# Altium project +5V2576输出模块.PrjPcb
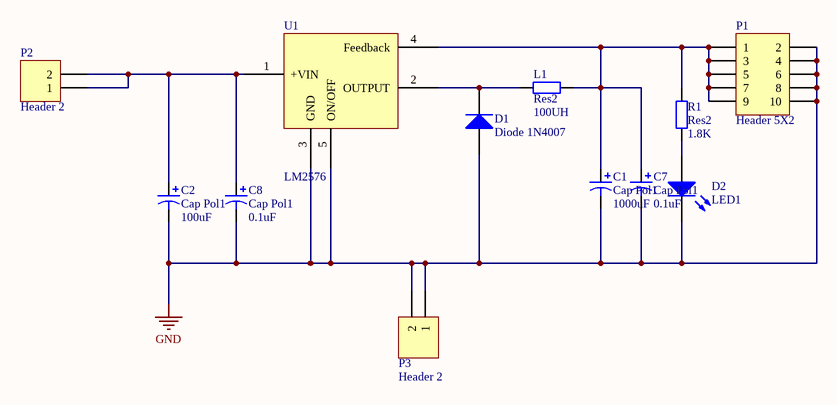
[diagram p0: +5V 2576.SchDoc]
1 sheet, 12 parts. Net scope: global (net labels, ports and power ports of the same name join across sheets).
Board file: PCB2576 5V.PcbDoc

## Sheet +5V 2576.SchDoc
size A4

### Parts
C1  Cap Pol1  value 1000uF  [CAPR5-4X5]
C2  Cap Pol1  value 100uF  [CAPR5-4X5]
C7  Cap Pol1  value 0.1uF  [CAPR5-4X5]
C8  Cap Pol1  value 0.1uF  [CAPR5-4X5]
D1  Diode 1N4007  [SMB]
D2  LED1  [LED-1]
L1  Res2  value 100UH  [AXIAL-0.4]
P1  Header 5X2  [HDR2X5]
P2  Header 2  [HDR1X2]
P3  Header 2  [HDR1X2]
R1  Res2  value 1.8K  [AXIAL-0.4]
U1  LM2576  [LM2576]

### Nets
GND: C1.2 C2.2 C7.2 C8.2 D1.1(A) D2.2(K) P1.2 P1.4 P1.6 P1.8 P1.10 P3.1 P3.2 U1.3(GND) U1.5(ON/OFF)
NetC1_1: C1.1 C7.1 L1.2 P1.1 P1.3 P1.5 P1.7 P1.9 R1.2 U1.4(Feedback)
NetC2_1: C2.1 C8.1 P2.1 P2.2 U1.1(+VIN)
NetD1_2: D1.2(K) L1.1 U1.2(OUTPUT)
NetD2_1: D2.1(A) R1.1

### Library data of the parts
C1 C2 C7 C8 = Cap Pol1: Polarized Capacitor (Radial); Published: 8-Jun-2000; LatestRevisionDate: 17-Jul-2002; LatestRevisionNote: Re-released for DXP Platform.; PackageReference: RB7.6-15; Publisher: Altium Limited; PackageDescription: Polarized Capacitor (Radial); 2 Leads
D1 = Diode 1N4007: 1 Amp General Purpose Rectifier; Published: 8-Jun-2000; LatestRevisionDate: 17-Jul-2002; LatestRevisionNote: Re-released for DXP Platform.; DatasheetVersion: 1998; PackageVersion: Aug-1999; PackageReference: DO-41; Publisher: Altium Limited; PackageDescription: Diode, Axial; Body 5.2 x 2.7 mm (LxDia. max), Lead Dia. 0.86 mm (max); Code_JEDEC: DO-204-AL; ComponentLink1Description: Manufacturer Link; ComponentLink1URL: http://www.fairchildsemi.com/; ComponentLink2Description: Datasheet; ComponentLink2URL: http://www.fairchildsemi.com/ds/1N%2F1N4001.pdf
D2 = LED1: Typical RED GaAs LED; Published: 8-Jun-2000; LatestRevisionDate: 08-Jul-2005; LatestRevisionNote: Mech Layer 1 removed.; PackageReference: LED-1; Publisher: Altium Limited; PackageDescription: LED; 2 Leads
L1 R1 = Res2: Resistor; Published: 8-Jun-2000; LatestRevisionDate: 17-Jul-2002; LatestRevisionNote: Re-released for DXP Platform.; PackageReference: AXIAL-0.4; Publisher: Altium Limited; PackageDescription: Axial Device, Thru-Hole; 2 Leads; 0.4 in Pin Spacing
P1 = Header 5X2: Header, 5-Pin, Dual row; LatestRevisionDate: 17-Jul-2002; LatestRevisionNote: Re-released for DXP Platform.; Publisher: Altium Limited
P2 P3 = Header 2: Header, 2-Pin; LatestRevisionDate: 17-Jul-2002; LatestRevisionNote: Re-released for DXP Platform.; Publisher: Altium Limited